# EAGLE design power_if (EAGLE 7.6.0)
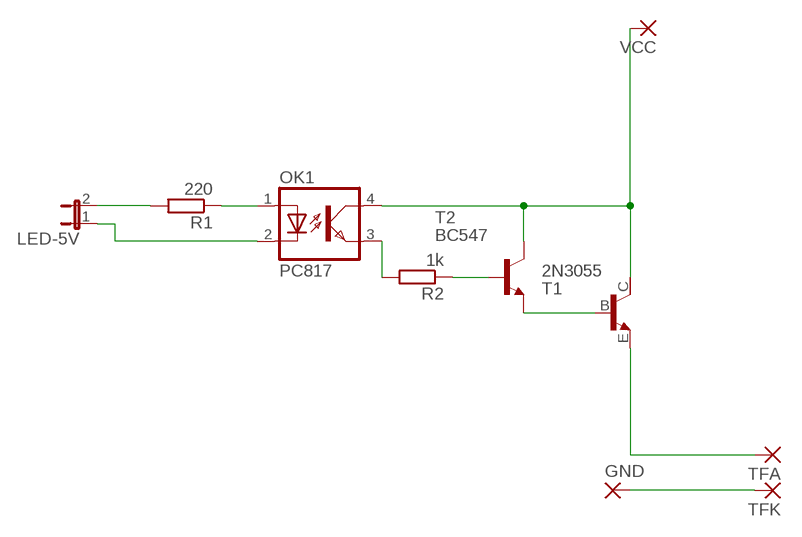
[diagram p0: schematic, sheet 1]

## Parts
GND  3,81/1,4  [3,81/1,4]
LED-5V  JP1E  [JP1]
OK1  PC817  [DIL04]
R1  220  R-EU_0207/10  [0207/10]
R2  1k  R-EU_0207/10  [0207/10]
T1  2N3055  [TO3]
T2  BC547  [TO92]
TFA  3,81/1,4  [3,81/1,4]
TFK  3,81/1,4  [3,81/1,4]
VCC  3,81/1,4  [3,81/1,4]

## Nets
N$1: OK1.4(COL) T1.C T2.3(C) VCC.1(P)
N$2: T1.B T2.1(E)
N$3: OK1.3(EMIT) R2.2
N$4: R2.1 T2.2(B)
N$5: OK1.1(A) R1.1
N$6: LED-5V.2 R1.2
N$7: LED-5V.1 OK1.2(C)
N$8: T1.E TFA.1(P)
N$9: GND.1(P) TFK.1(P)
Unconnected: T1.C/(C)

## Library data of the parts
GND TFA TFK VCC = wirepad:3,81/1,4: THROUGH-HOLE PAD
LED-5V = jumper:JP1E: JUMPER
OK1 = optocoupler:PC817: SHARP OPTO COUPLER; MPN: PC817X4J000F; OC_FARNELL: 9707727; OC_NEWARK: 97K7059
R1 R2 = rcl:R-EU_: RESISTOR, European symbol
T1 = transistor-neu-to92:2N3055: NPN TRANSISTOR
T2 = transistor:BC547: NPN TRANSISTOR

## Board
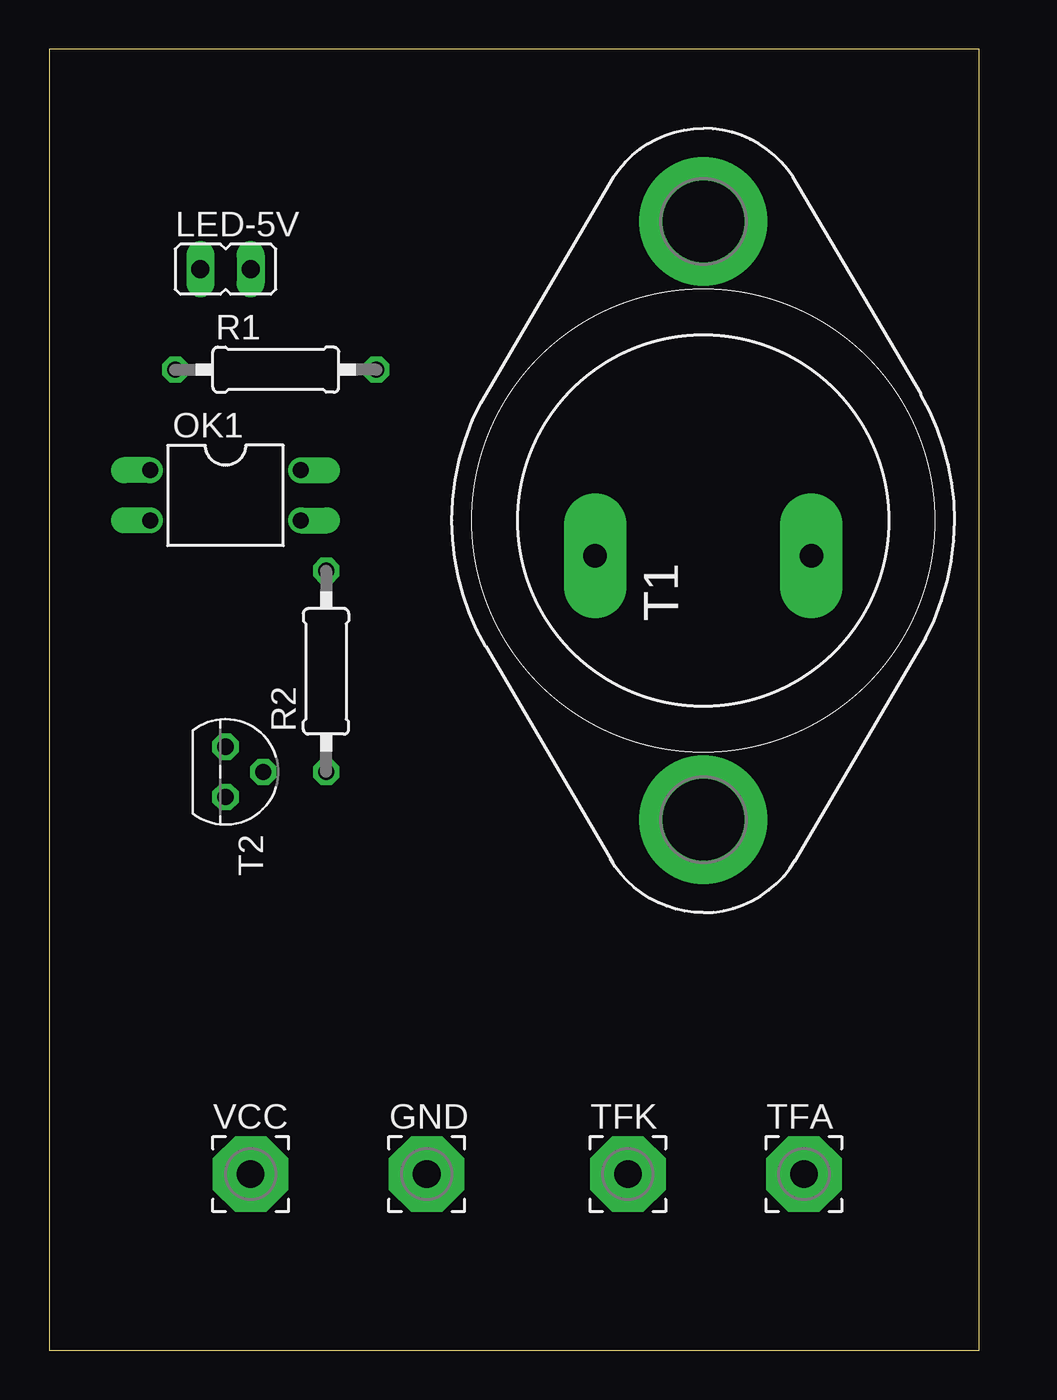
[diagram p1: board, top side]
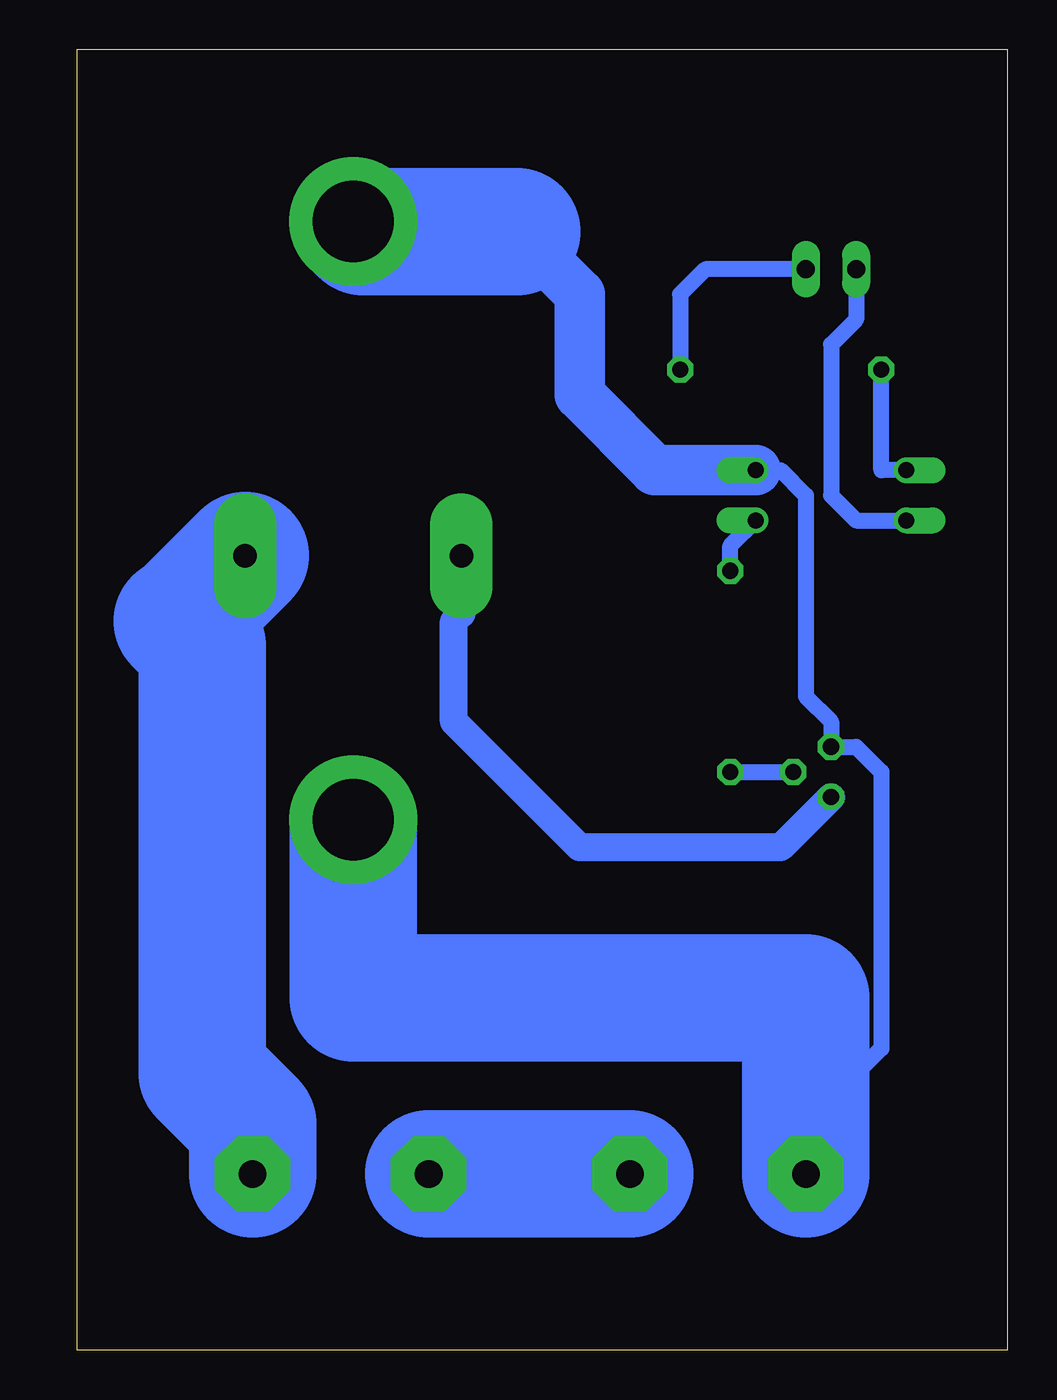
[diagram p2: board, bottom side, seen from below]

Size 46.97 x 65.71 mm. Coordinates in mm from the lower left corner, seen from the top.
Outline: 0,0 46.97,0 46.97,65.71 0,65.71 0,0
Copper layers (1*16): Top 0.035mm / dielectric 1.5mm / Bottom 0.035mm
Design rules "default": minimum track width 10mil, minimum drill 24mil, track to track 8mil, track to pad 8mil, pad to pad 8mil, via to via 8mil, smd to smd 8mil, copper to edge 40mil, drill to drill 8mil, minimum pad ring 10mil, minimum via ring 8mil, stop-mask expansion 4mil, vias tented up to drill 0mil, thermal gap 10mil

### Footprints (pad centres in the part's own frame; a part is rotated, then mirrored left to right if it is on the bottom)
3,81/1,4 = drill 1.397 pad 3.81 octagon: 1 0,0
JP1 = drill 0.914 long: 1 0,-1.27; 2 0,1.27
DIL04 = drill 0.813 offset: 1 -1.27,-3.81; 2 1.27,-3.81; 3 1.27,3.81; 4 -1.27,3.81
0207/10 = drill 0.813 octagon: 1 -5.08,0; 2 5.08,0
TO3 = drill 1.194 pad 3.15 long: B -1.778,5.461; E -1.778,-5.461 | drill 4.115 pad 6.477: C 15.113,0; C/ -15.113,0
TO92 = drill 0.813 octagon: 1 1.27,0; 2 0,1.905; 3 -1.27,0

### Placement (x,y rotation side)
GND  19.05,8.89 0 top
LED-5V  8.89,54.61 270 top
OK1  8.89,43.18 270 top
R1  11.43,49.53 0 top
R2  13.97,34.29 90 top
T1  33.02,41.91 90 top
T2  8.89,29.21 270 top
TFA  38.1,8.89 0 top
TFK  29.21,8.89 0 top
VCC  10.16,8.89 0 top

### Tracks (layer width: path | path; a pad name or v marks a point on that pad's centre or on a via)
N$1
  Bottom 0.813: OK1.4 11.43,44.45 10.16,43.18 10.16,33.02 8.89,31.75 T2.3 7.62,30.48 6.35,29.21 6.35,15.24 10.16,11.43 VCC.1
  Bottom 2.54: OK1.4 17.78,44.45 21.59,48.26 21.59,53.34 24.77,56.52 25.4,57.15
  Bottom 6.452: T1.C 32.51,56.52 24.77,56.52 | VCC.1 10.16,17.78 33.02,17.78 33.02,26.67
N$2
  Bottom 1.422: T2.1 11.43,25.4 21.59,25.4 27.94,31.75 27.94,36.83 27.56,37.21 T1.B
N$3
  Bottom 0.813: R2.2 13.97,40.64 OK1.3
N$4
  Bottom 0.813: R2.1 T2.2
N$5
  Bottom 0.813: OK1.1 6.35,44.45 R1.1
N$6
  Bottom 0.813: LED-5V.2 15.24,54.61 16.51,53.34 R1.2
N$7
  Bottom 0.813: LED-5V.1 7.62,52.07 8.89,50.8 8.89,43.18 7.62,41.91 OK1.2
N$8
  Bottom 6.452: T1.E 41.78,36.83 41.91,36.83 40.64,35.56 40.64,21.59 40.64,19.05 40.64,13.97 38.1,11.43 TFA.1
N$9
  Bottom 6.452: TFK.1 GND.1